# Altium schematic sheet VGAConnection.SchDoc
size A4; SheetNumber: 3; SheetTotal: 6
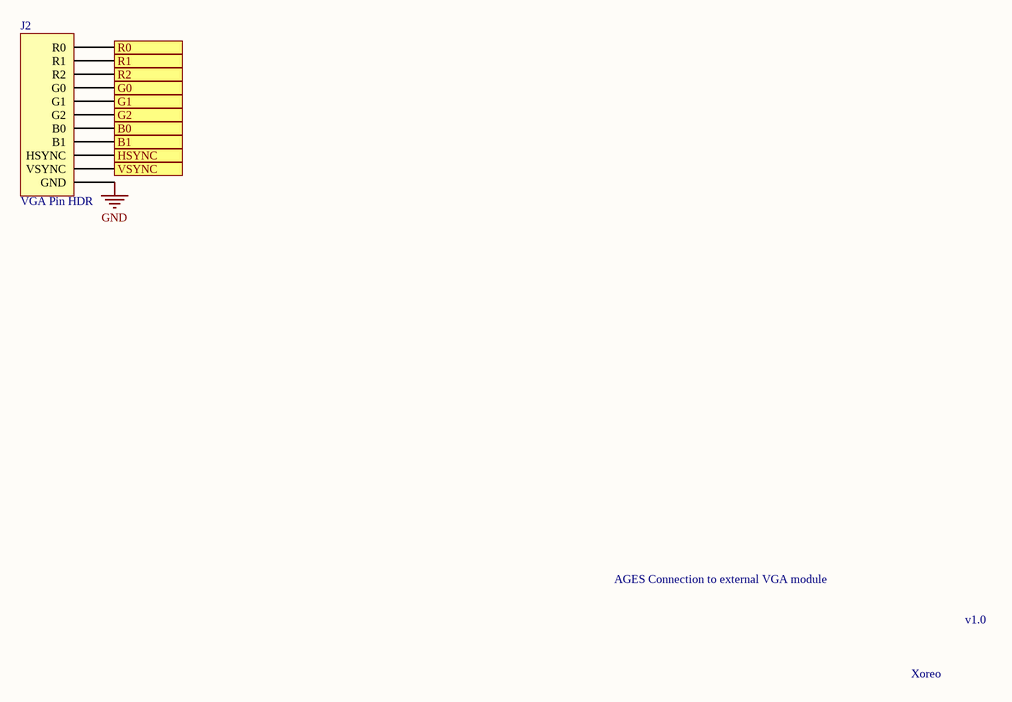
[diagram p0: VGAConnection.SchDoc]

## Parts
J2  VGA Pin HDR  [VGA HDR]

## Ports
B0, B1, G0, G1, G2, HSYNC, R0, R1, R2, VSYNC

## Nets
GND: J2.11(GND)
B0: J2.7(B0) ; port B0
B1: J2.8(B1) ; port B1
G0: J2.4(G0) ; port G0
G1: J2.5(G1) ; port G1
G2: J2.6(G2) ; port G2
HSYNC: J2.9(HSYNC) ; port HSYNC
R0: J2.1(R0) ; port R0
R1: J2.2(R1) ; port R1
R2: J2.3(R2) ; port R2
VSYNC: J2.10(VSYNC) ; port VSYNC

## Notes on the sheet
- AGES Connection to external VGA module
- v1.0
- Xoreo

## Library data of the parts
J2 = Connector: VGA HDR: VGA pin male header